# EAGLE design Adapter (EAGLE 6.5.0)
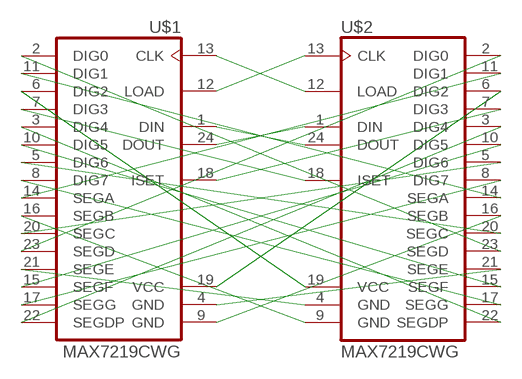
[diagram p0: schematic, sheet 1]

## Parts
U$1  MAX7219CWG  [SO24L]
U$2  MAX7219CWG  [TSSOP24]

## Nets
N$1: U$1.24(DOUT) U$2.1(DIN)
N$2: U$1.1(DIN) U$2.24(DOUT)
N$3: U$1.23(SEGD) U$2.2(DIG0)
N$4: U$1.2(DIG0) U$2.23(SEGD)
N$5: U$1.3(DIG4) U$2.22(SEGDP)
N$6: U$1.22(SEGDP) U$2.3(DIG4)
N$7: U$1.4(GND) U$2.21(SEGE)
N$8: U$1.21(SEGE) U$2.4(GND)
N$9: U$1.5(DIG6) U$2.20(SEGC)
N$10: U$1.20(SEGC) U$2.5(DIG6)
N$11: U$1.6(DIG2) U$2.19(VCC)
N$12: U$1.19(VCC) U$2.6(DIG2)
N$13: U$1.7(DIG3) U$2.18(ISET)
N$14: U$1.18(ISET) U$2.7(DIG3)
N$15: U$1.8(DIG7) U$2.17(SEGG)
N$16: U$1.17(SEGG) U$2.8(DIG7)
N$17: U$1.9(GND) U$2.16(SEGB)
N$18: U$1.16(SEGB) U$2.9(GND)
N$19: U$1.10(DIG5) U$2.15(SEGF)
N$20: U$1.15(SEGF) U$2.10(DIG5)
N$21: U$1.11(DIG1) U$2.14(SEGA)
N$22: U$1.14(SEGA) U$2.11(DIG1)
N$23: U$1.13(CLK) U$2.12(LOAD)
N$24: U$1.12(LOAD) U$2.13(CLK)

## Library data of the parts
U$1 = max7219:MAX7219CWG
U$2 = maxim:MAX7219CWG

## Board
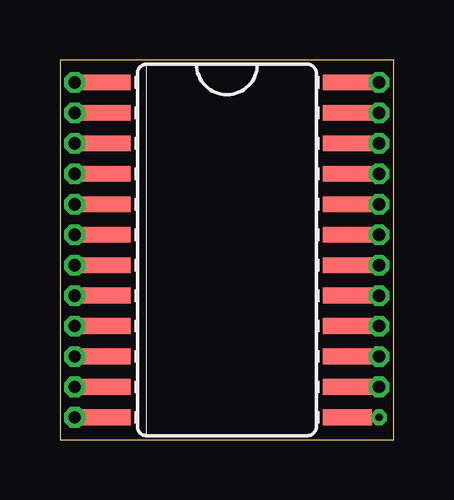
[diagram p1: board, top side]
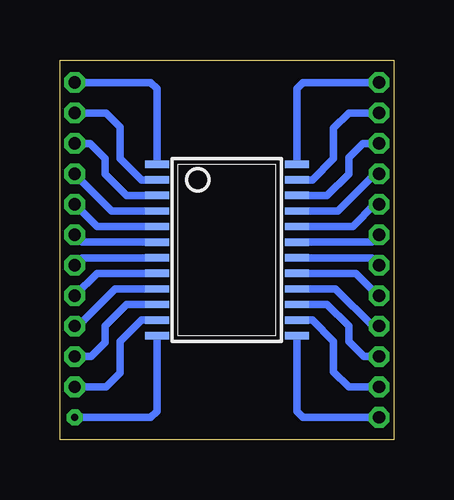
[diagram p2: board, bottom side, seen from below]

Size 13.93 x 15.85 mm. Coordinates in mm from the lower left corner, seen from the top.
Outline: 0,0 13.93,0 13.93,15.85 0,15.85 0,0
Copper layers (1*16): Top 0.0356mm / dielectric 1.5011mm / Bottom 0.0356mm
Design rules "LaenPCBOrder": minimum track width 6mil, minimum drill 13mil, track to track 6mil, track to pad 6mil, pad to pad 6mil, via to via 6mil, smd to smd 6mil, copper to edge 15mil, drill to drill 6mil, minimum pad ring 7mil, minimum via ring 7mil, stop-mask expansion 3mil, vias tented up to drill 0mil, thermal gap 10mil

### Footprints (pad centres in the part's own frame; a part is rotated, then mirrored left to right if it is on the bottom)
SO24L = smd 0.66 x 2.032: 1 -6.985,-5.029; 2 -5.715,-5.029; 3 -4.445,-5.029; 4 -3.175,-5.029; 5 -1.905,-5.029; 6 -0.635,-5.029; 7 0.635,-5.029; 8 1.905,-5.029; 9 3.175,-5.029; 10 4.445,-5.029; 11 5.715,-5.029; 12 6.985,-5.029; 13 6.985,5.029; 14 5.715,5.029; 15 4.445,5.029; 16 3.175,5.029; 17 1.905,5.029; 18 0.635,5.029; 19 -0.635,5.029; 20 -1.905,5.029; 21 -3.175,5.029; 22 -4.445,5.029; 23 -5.715,5.029; 24 -6.985,5.029
TSSOP24 = smd 0.305 x 0.991: 1 -3.575,-2.918; 2 -2.925,-2.918; 3 -2.275,-2.918; 4 -1.625,-2.918; 5 -0.975,-2.918; 6 -0.325,-2.918; 7 0.325,-2.918; 8 0.975,-2.918; 9 1.625,-2.918; 10 2.275,-2.918; 11 2.925,-2.918; 12 3.575,-2.918; 13 3.575,2.918; 14 2.925,2.918; 15 2.275,2.918; 16 1.625,2.918; 17 0.975,2.918; 18 0.325,2.918; 19 -0.325,2.918; 20 -0.975,2.918; 21 -1.625,2.918; 22 -2.275,2.918; 23 -2.925,2.918; 24 -3.575,2.918

### Placement (x,y rotation side)
U$1  6.96,7.92 270 top
U$2  6.96,7.92 270 bottom

### Tracks (layer width: path | path; a pad name or v marks a point on that pad's centre or on a via)
N$1  (via drill 0.51)
  Top 0.305: v13.31,14.91 U$1.24
  Bottom 0.305: U$2.1 9.88,14.65 10.14,14.91 v13.31,14.91
N$2  (via drill 0.51)
  Top 0.305: v0.62,14.91 U$1.1
  Bottom 0.305: U$2.24 4.05,14.65 3.79,14.91 v0.62,14.91
N$3  (via drill 0.51)
  Top 0.305: v13.31,13.64 U$1.23
  Bottom 0.305: U$2.2 10.53,10.85 11.41,11.73 11.41,13.06 U$1.23 v13.31,13.64
N$4  (via drill 0.51)
  Top 0.305: v0.62,13.64 U$1.2
  Bottom 0.305: U$2.23 3.4,10.85 2.52,11.73 2.52,13 1.88,13.64 v0.62,13.64
N$5  (via drill 0.51)
  Top 0.305: v0.62,12.37 U$1.3
  Bottom 0.305: U$2.22 2.79,10.2 1.88,11.1 1.88,11.79 1.3,12.37 v0.62,12.37
N$6  (via drill 0.51)
  Top 0.305: v13.31,12.37 U$1.22
  Bottom 0.305: U$2.3 11.14,10.2 12.04,11.1 12.04,11.73 12.68,12.37 v13.31,12.37
N$7  (via drill 0.51)
  Top 0.305: U$1.4 v0.62,11.1
  Bottom 0.305: v0.62,11.1 0.79,11.1 2.34,9.55 U$2.21
N$8  (via drill 0.51)
  Top 0.305: v13.31,11.1 U$1.21
  Bottom 0.305: U$2.4 11.77,9.55 v13.31,11.1
N$9  (via drill 0.51)
  Top 0.305: U$1.5 v0.62,9.83
  Bottom 0.305: v0.62,9.83 0.79,9.83 1.72,8.9 U$2.20
N$10  (via drill 0.51)
  Top 0.305: v13.31,9.83 U$1.20
  Bottom 0.305: U$2.5 12.38,8.9 v13.31,9.83
N$11  (via drill 0.51)
  Top 0.305: U$1.6 1.25,8.56 v0.62,8.56
  Bottom 0.305: U$2.19 0.92,8.25 v0.62,8.56
N$12  (via drill 0.51)
  Top 0.305: v13.31,8.56 U$1.19
  Bottom 0.305: U$2.6 13,8.25 v13.31,8.56
N$13  (via drill 0.51)
  Top 0.305: v0.62,7.29 U$1.7
  Bottom 0.305: U$2.18 0.92,7.6 v0.62,7.29
N$14  (via drill 0.51)
  Top 0.305: v13.31,7.29 U$1.18
  Bottom 0.305: U$2.7 13,7.6 v13.31,7.29
N$15  (via drill 0.51)
  Top 0.305: v0.62,6.02 U$1.8
  Bottom 0.305: U$2.17 1.6,6.95 0.67,6.02 v0.62,6.02
N$16  (via drill 0.51)
  Top 0.305: v13.31,6.02 U$1.17
  Bottom 0.305: U$2.8 12.38,6.95 v13.31,6.02
N$17  (via drill 0.51)
  Top 0.305: U$1.9 v0.62,4.75
  Bottom 0.305: v0.62,4.75 0.88,4.75 2.43,6.3 U$2.16
N$18  (via drill 0.51)
  Top 0.305: v13.31,4.75 U$1.16
  Bottom 0.305: U$2.9 11.63,6.3 13.18,4.75 v13.31,4.75
N$19  (via drill 0.51)
  Top 0.305: v0.62,3.48 U$1.10
  Bottom 0.305: U$2.15 2.79,5.65 1.88,4.75 1.88,4.12 1.25,3.48 v0.62,3.48
N$20  (via drill 0.51)
  Top 0.305: v13.31,3.48 U$1.15
  Bottom 0.305: U$2.10 11.14,5.65 12.04,4.75 12.04,4.06 12.63,3.48 v13.31,3.48
N$21  (via drill 0.51)
  Top 0.305: v0.62,2.21 U$1.11
  Bottom 0.305: U$2.14 3.4,5 2.52,4.12 2.52,2.84 1.88,2.21 v0.62,2.21
N$22  (via drill 0.51)
  Top 0.305: v13.31,2.21 U$1.14
  Bottom 0.305: U$2.11 10.53,5 11.41,4.12 11.41,2.79 U$1.14 v13.31,2.21
N$23  (via drill 0.3)
  Top 0.305: v13.31,0.94 U$1.13
  Bottom 0.305: U$2.12 9.88,1.2 10.14,0.94 v13.31,0.94
N$24  (via drill 0.51)
  Top 0.305: v0.62,0.94 U$1.12
  Bottom 0.305: U$2.13 4.05,1.2 3.79,0.94 v0.62,0.94